# EAGLE design lumen (EAGLE 9.6.2)
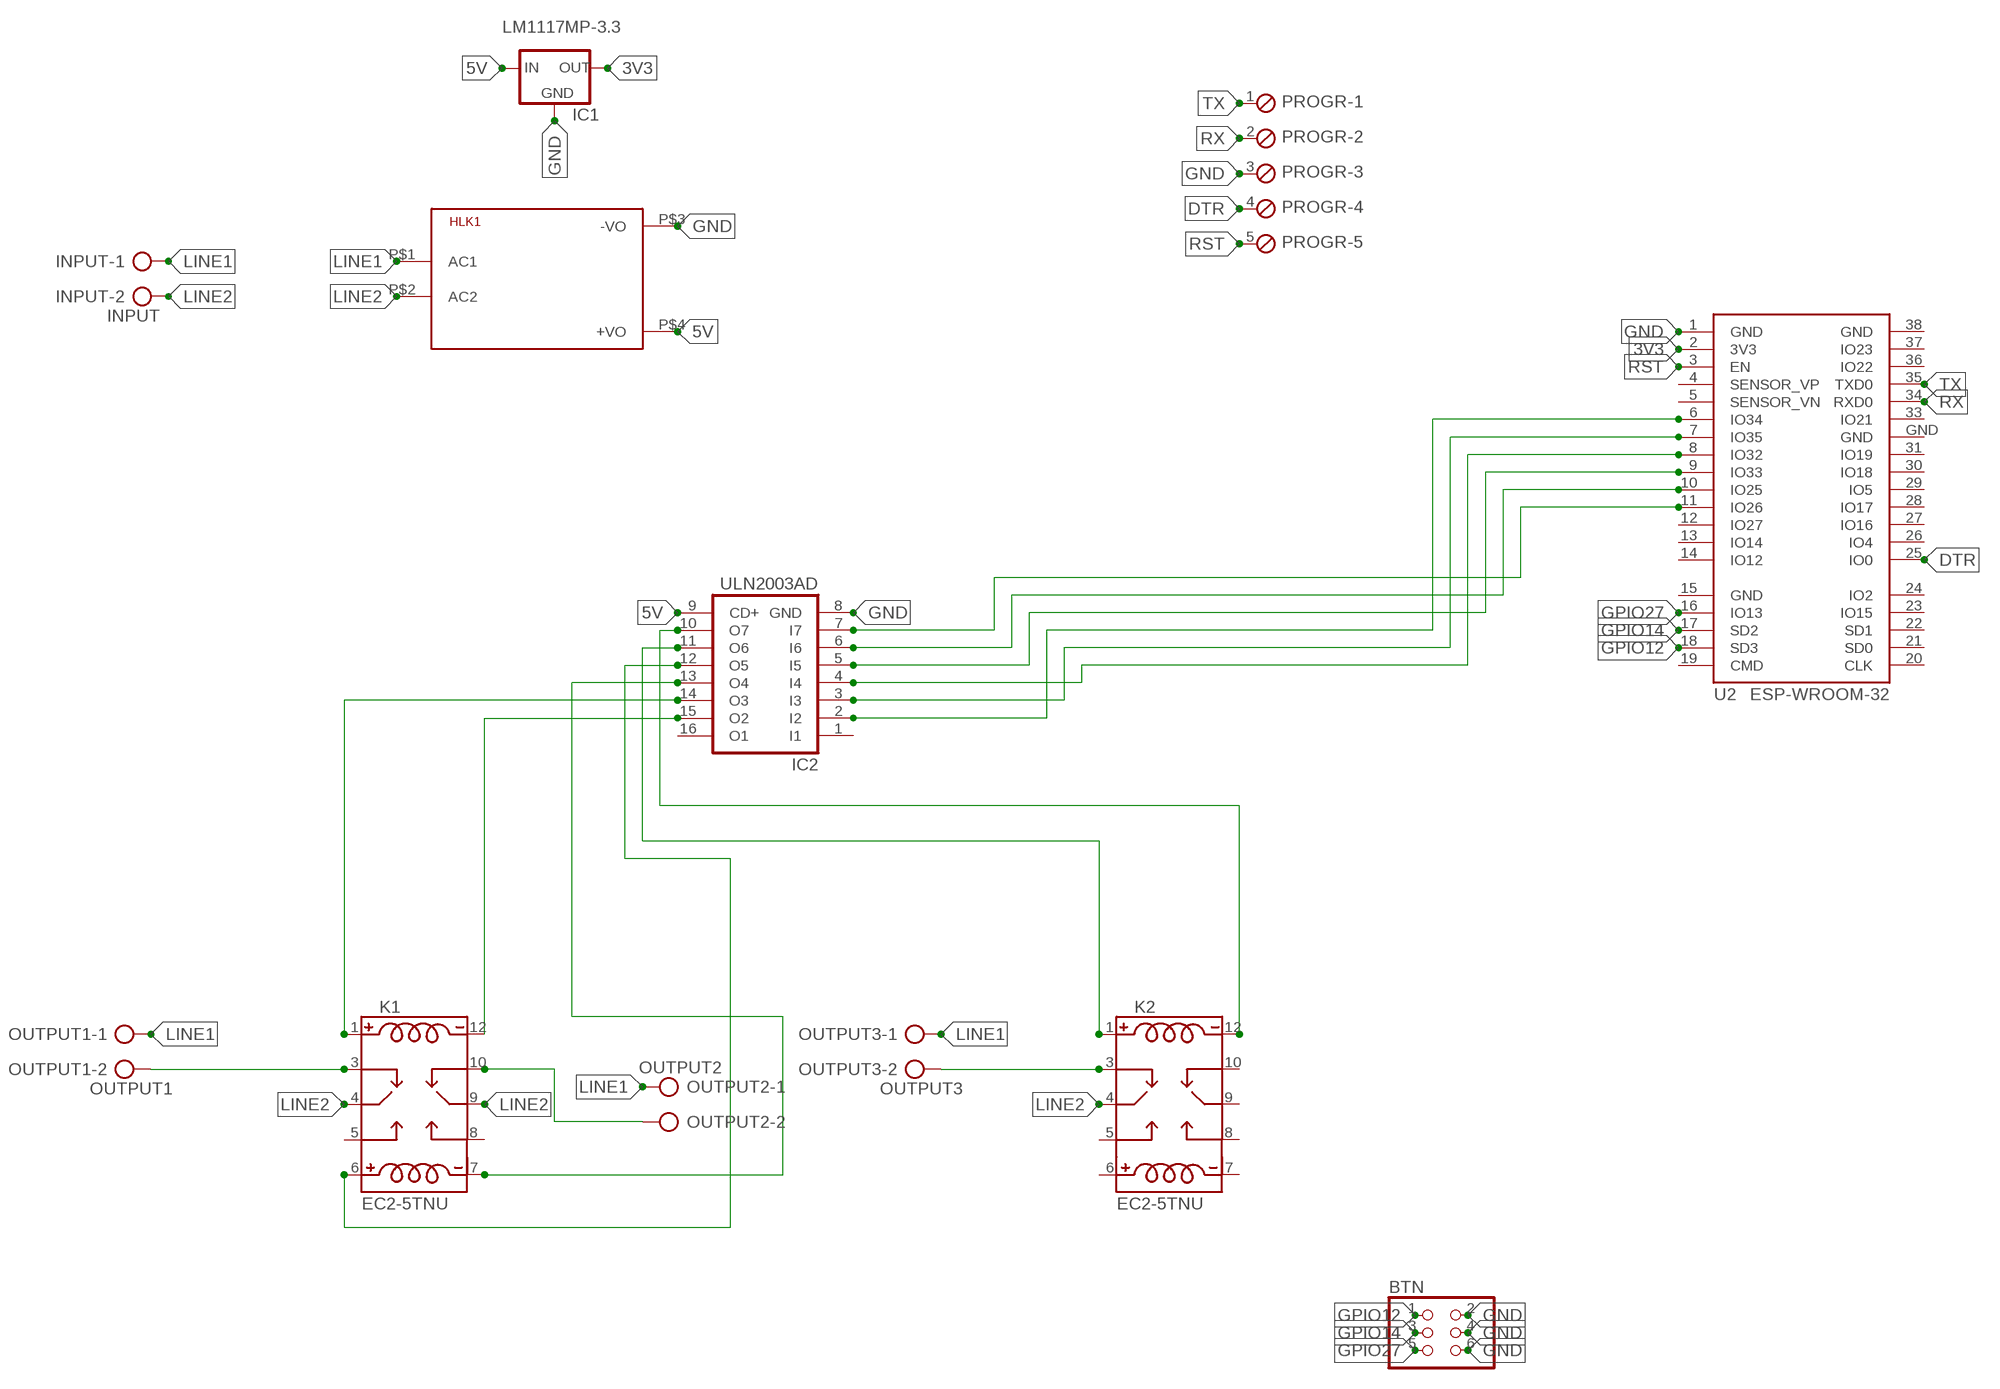
[diagram p0: schematic, sheet 1]

## Parts
BTN  PINHD-2X3  [2X03]
HLK1  HLK-PM013W  [HLK-PM01]
IC1  LM1117MP-3.3  [SOT223]
IC2  ULN2003AD  [SO16]
INPUT  INPUT  AK300/2  [AK300/2]
K1  EC2-5TNU  [RELAY_EC2-5TNU]
K2  EC2-5TNU  [RELAY_EC2-5TNU]
OUTPUT1  OUTPUT1  AK300/2  [AK300/2]
OUTPUT2  OUTPUT2  AK300/2  [AK300/2]
OUTPUT3  OUTPUT3  AK300/2  [AK300/2]
PROGR  MPT5  [5POL254]
U2  ESP-WROOM-32  [ESP-WROOM-32]

## Nets
3V3: IC1.2(OUT) IC1.4(OUT) U2.2(3V3)
5V: HLK1.P$4(+VO) IC1.3(IN) IC2.9(CD+)
DTR: PROGR.4 U2.25(IO0)
GND: BTN.2 BTN.4 BTN.6 HLK1.P$3(-VO) IC1.1(GND) IC2.8(GND) PROGR.3 U2.1(GND)
GPIO12: BTN.1 U2.18(SD3)
GPIO14: BTN.3 U2.17(SD2)
GPIO27: BTN.5 U2.16(IO13)
LINE1: HLK1.P$1(AC1) INPUT.1 OUTPUT1.1 OUTPUT2.1 OUTPUT3.1
LINE2: HLK1.P$2(AC2) INPUT.2 K1.4(M1) K1.9(M) K2.4(M1)
N$1: IC2.11(O6) K2.1(C1)
N$2: K2.3(NC1) OUTPUT3.2
N$3: IC2.10(O7) K2.12(C2)
N$4: IC2.15(O2) K1.12(C2)
N$5: IC2.14(O3) K1.1(C1)
N$6: K1.3(NC1) OUTPUT1.2
N$8: K1.10(NC) OUTPUT2.2
N$9: IC2.2(I2) U2.6(IO34)
N$11: IC2.13(O4) K1.7(C4)
N$13: IC2.12(O5) K1.6(C3)
N$15: IC2.3(I3) U2.7(IO35)
N$16: IC2.4(I4) U2.8(IO32)
N$17: IC2.5(I5) U2.9(IO33)
N$18: IC2.6(I6) U2.10(IO25)
N$19: IC2.7(I7) U2.11(IO26)
RST: PROGR.5 U2.3(EN)
RX: PROGR.2 U2.34(RXD0)
TX: PROGR.1 U2.35(TXD0)
Unconnected: IC2.1(I1) IC2.16(O1) K1.5(NO1) K1.8(NO) K2.5(NO1) K2.6(C3) K2.7(C4) K2.8(NO) K2.9(M) K2.10(NC) U2.4(SENSOR_VP) U2.5(SENSOR_VN) U2.12(IO27) U2.13(IO14) U2.14(IO12) U2.19(CMD) U2.20(CLK) U2.21(SD0) U2.22(SD1) U2.23(IO15) U2.24(IO2) U2.26(IO4) U2.27(IO16) U2.28(IO17) U2.29(IO5) U2.30(IO18) U2.31(IO19) U2.33(IO21) U2.36(IO22) U2.37(IO23)

## Power pins joined to a net without a drawn wire
GND: U2.15(GND) U2.38(GND) U2.GND

## Library data of the parts
BTN = pinhead:PINHD-2X3: PIN HEADER
HLK1 = HLK-PM01:HLK-PM01: Hi-Link Power Supply HLK-PM01 3W Author: Ahmed Said <https://github.com/AhmedSaid/EAGLELibraries>
IC1 = lm1117_10:LM1117?-*: 800mA Low-Dropout Linear Regulator Source: http://www.ti.com/lit/ds/symlink/lm1117-n.pdf; MF: Texas Instruments; MPN: LM1117MP-3.3; OC_FARNELL: 9778195; OC_NEWARK: 28X3416
IC2 = uln-udn:ULN2003A: DRIVER ARRAY
INPUT OUTPUT1-OUTPUT3 = MY-AK300:AK300/2: CONNECTOR; OC_FARNELL: unknown; OC_NEWARK: unknown
K1 K2 = EC2-5TNU:EC2-5TNU: Relay; E-Mech; Latching; DPDT; Ctrl-V 5DC; 2A; 250VAC; PCB Mnt; Thru Hole; EC2/EE2 Series Check prices <https://pricing.snapeda.com/parts/EC2-5TNU/KEMET/view-part?ref=eda>; AVAILABILITY: Good; DESCRIPTION: General Purpose Relay DPDT (2 Form C) Through Hole; MF: KEMET; MP: EC2-5TNU; PACKAGE: None; PRICE: None; PURCHASE-URL: https://pricing.snapeda.com/search/part/EC2-5TNU/?ref=eda
PROGR = con-phoenix-254:MPT5: PHOENIX CONNECTOR; OC_FARNELL: unknown; OC_NEWARK: unknown
U2 = esp32:ESP-WROOM-32: Espressif Systems ESP-WROOM-32

## Board
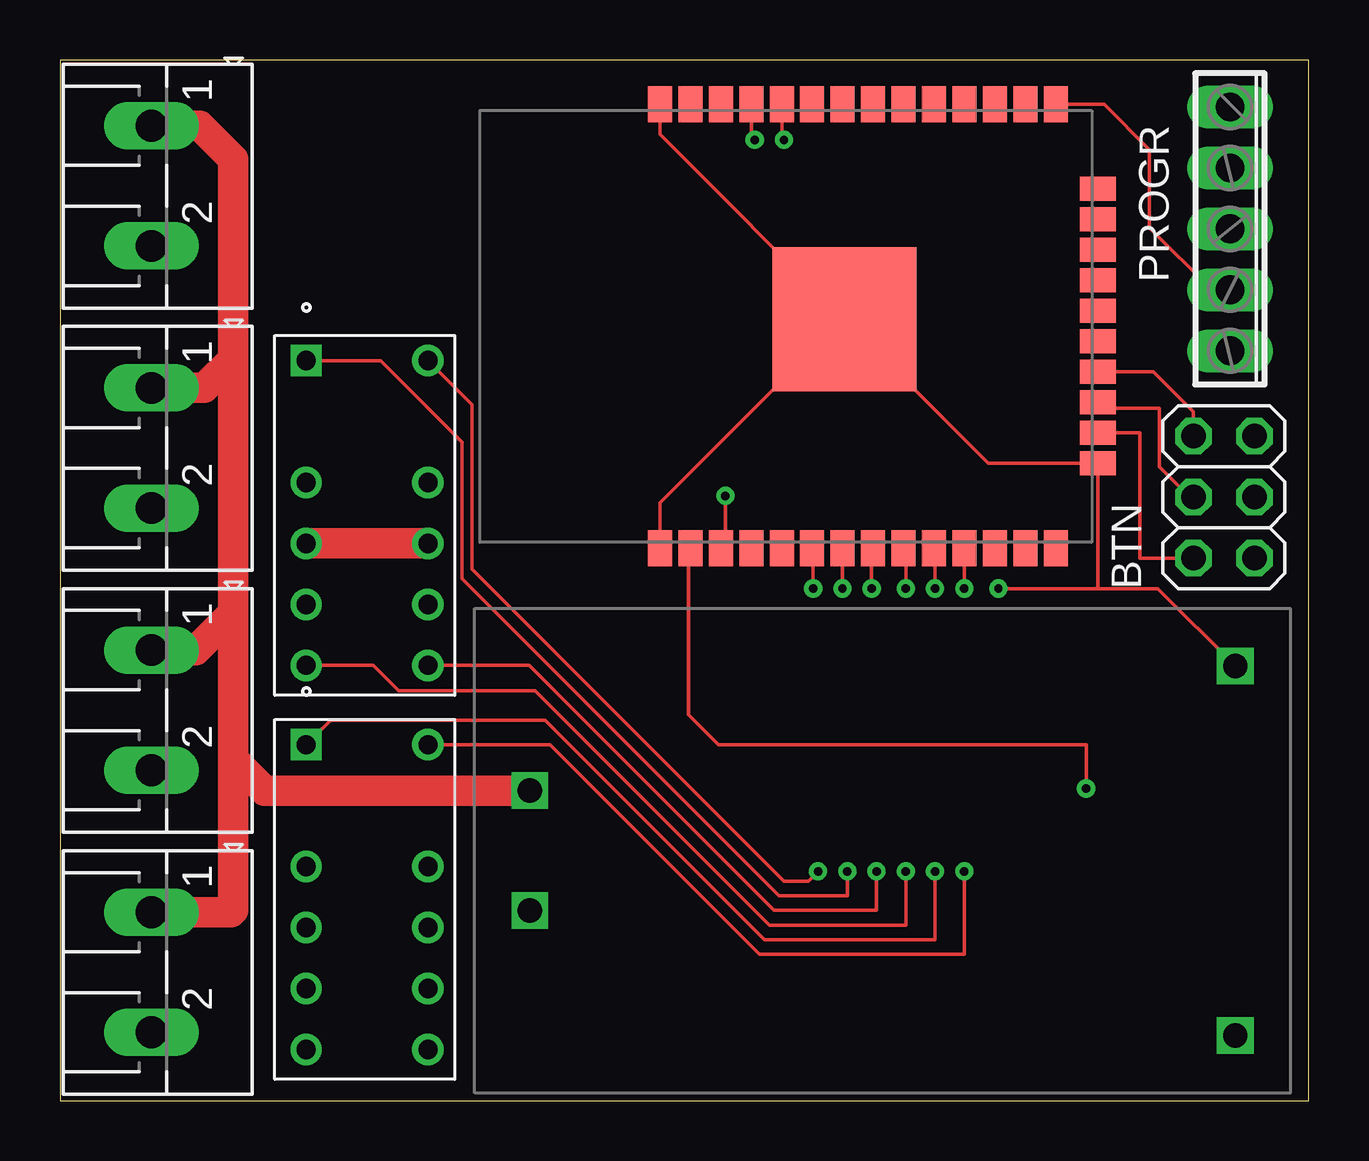
[diagram p1: board, top side]
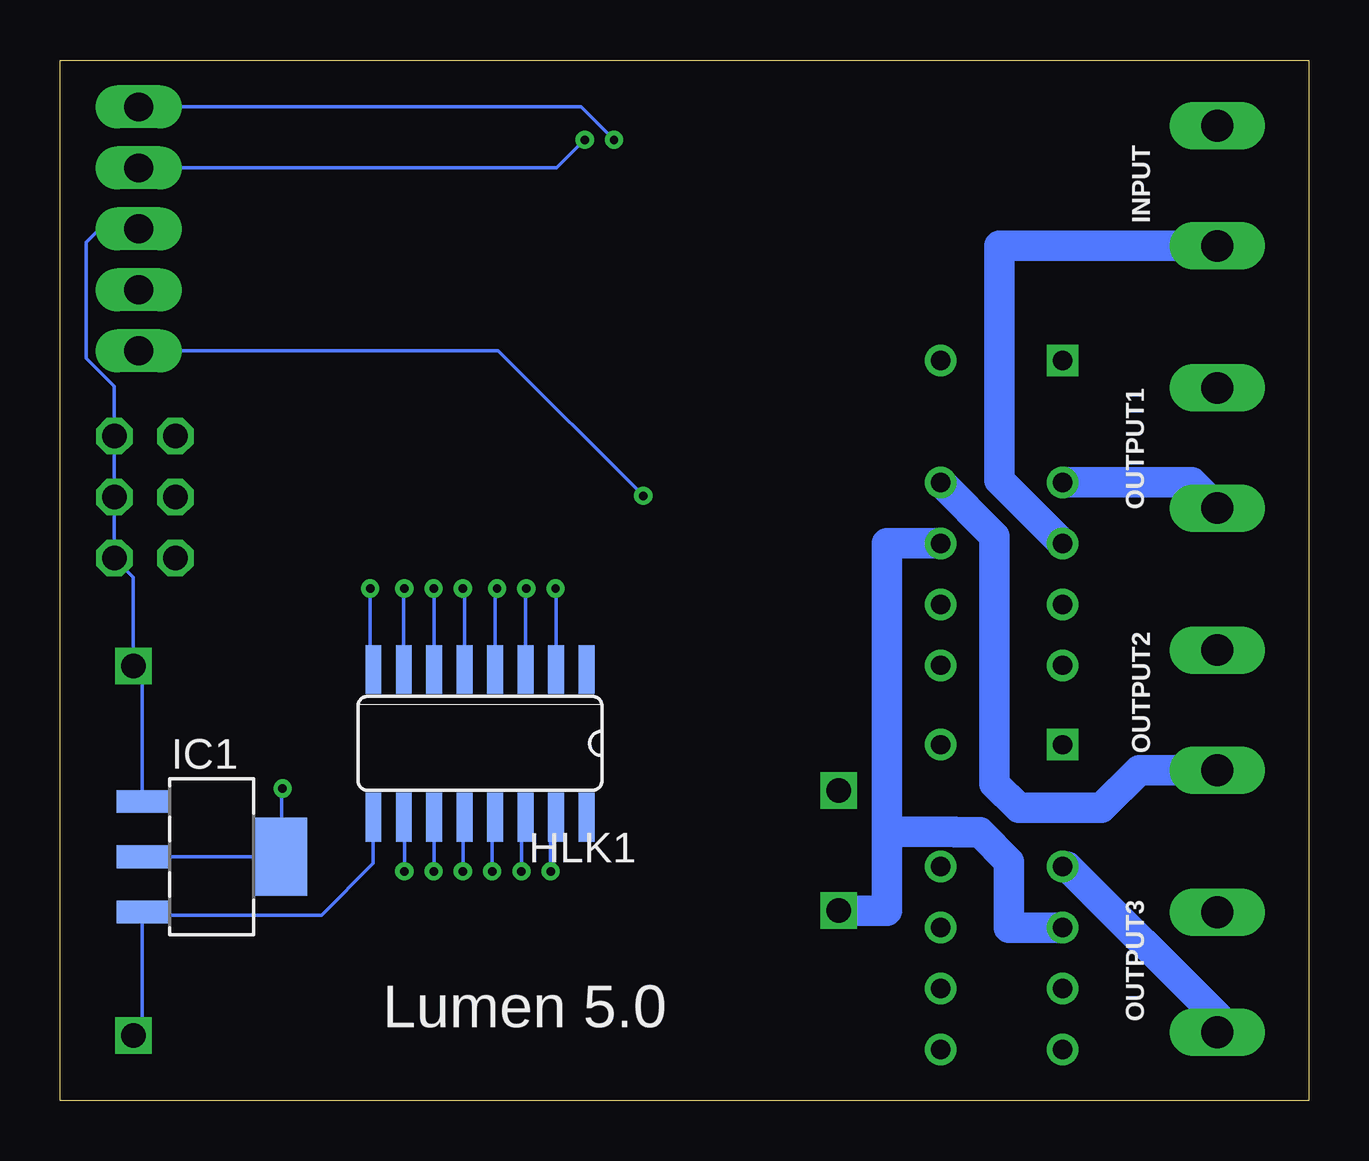
[diagram p2: board, bottom side, seen from below]

Size 52.05 x 43.36 mm. Coordinates in mm from the lower left corner, seen from the top.
Outline: 0,0 52.05,0 52.05,43.36 0,43.36 0,0
Copper layers (1*16): Top 0.035mm / dielectric 1.5mm / Bottom 0.035mm
Design rules "default": minimum track width 6mil, minimum drill 0.35mm, track to track 6mil, track to pad 6mil, pad to pad 6mil, via to via 6mil, smd to smd 6mil, copper to edge 40mil, drill to drill 6mil, minimum pad ring 10mil, minimum via ring 8mil, stop-mask expansion 4mil, vias tented up to drill 0mil, thermal gap 10mil

### Footprints (pad centres in the part's own frame; a part is rotated, then mirrored left to right if it is on the bottom)
2X03 = drill 1.016 octagon: 1 -2.54,-1.27; 2 -2.54,1.27; 3 0,-1.27; 4 0,1.27; 5 2.54,-1.27; 6 2.54,1.27
HLK-PM01 = drill 1.016 square: P$1 -14.7,2.5; P$2 -14.7,-2.5; P$3 14.7,7.7; P$4 14.7,-7.7
SOT223 = smd 0.95 x 2.15: 1 -2.3,-2.9; 2 0,-2.9; 3 2.3,-2.9 | smd 3.25 x 2.15: 4 0,2.9
SO16 = smd 0.66 x 2.032: 1 -4.445,-3.073; 2 -3.175,-3.073; 3 -1.905,-3.073; 4 -0.635,-3.073; 5 0.635,-3.073; 6 1.905,-3.073; 7 3.175,-3.073; 8 4.445,-3.073; 9 4.445,3.073; 10 3.175,3.073; 11 1.905,3.073; 12 0.635,3.073; 13 -0.635,3.073; 14 -1.905,3.073; 15 -3.175,3.073; 16 -4.445,3.073
AK300/2 = drill 1.321 long: 1 -2.515,0; 2 2.489,0
RELAY_EC2-5TNU = drill 0.8 square: 1 -6.45,-2.44 | drill 0.8: 3 -1.37,-2.44; 4 1.17,-2.44; 5 3.71,-2.44; 6 6.25,-2.44; 7 6.25,2.64; 8 3.71,2.64; 9 1.17,2.64; 10 -1.37,2.64; 12 -6.45,2.64
5POL254 = drill 1.2 long: 1 -5.08,0; 2 -2.54,0; 3 0,0; 4 2.54,0; 5 5.08,0
ESP-WROOM-32 = smd 1.5 x 1: 1 -9.25,7; 2 -9.25,5.73; 3 -9.25,4.46; 4 -9.25,3.19; 5 -9.25,1.92; 6 -9.25,0.65; 7 -9.25,-0.62; 8 -9.25,-1.89; 9 -9.25,-3.16; 10 -9.25,-4.43; 11 -9.25,-5.7; 12 -9.25,-6.97; 13 -9.25,-8.24; 14 -9.25,-9.51; 25 9.25,-9.51; 26 9.25,-8.24; 27 9.25,-6.97; 28 9.25,-5.7; 29 9.25,-4.43; 30 9.25,-3.16; 31 9.25,-1.89; 32 9.25,-0.62; 33 9.25,0.65; 34 9.25,1.92; 35 9.25,3.19; 36 9.25,4.46; 37 9.25,5.73; 38 9.25,7 | smd 1 x 1.5: 15 -5.7,-11.25; 16 -4.43,-11.25; 17 -3.16,-11.25; 18 -1.89,-11.25; 19 -0.62,-11.25; 20 0.65,-11.25; 21 1.92,-11.25; 22 3.19,-11.25; 23 4.46,-11.25; 24 5.73,-11.25 | smd 6 x 6: GND 0.3,-0.7

### Placement (x,y rotation side)
BTN  48.51,25.15 270 top
HLK1  34.29,10.41 0 top
IC1  45.72,10.16 270 bottom
IC2  34.54,14.88 180 bottom
INPUT  3.81,38.1 270 top
K1  12.7,24.38 270 top
K2  12.7,8.38 270 top
OUTPUT1  3.81,27.18 270 top
OUTPUT2  3.81,16.26 270 top
OUTPUT3  3.81,5.33 270 top
PROGR  48.77,36.32 270 top
U2  32,32.26 90 top

### Tracks (layer width: path | path; a pad name or v marks a point on that pad's centre or on a via)
3V3  (via drill 0.35)
  Top 0.152: U2.2 26.21,22.94 26.21,16.07 27.44,14.83 42.77,14.83 v42.77,13.01
  Bottom 0.152: IC1.2 IC1.4 42.82,12.96 v42.77,13.01
5V
  Bottom 0.152: IC2.9 38.99,9.88 41.15,7.72 48.48,7.72 IC1.3 48.62,3.08 HLK1.P$4
DTR
  Top 0.152: PROGR.4 48.01,33.78 45.41,36.37 45.41,39.62 43.53,41.51 U2.25
GND  (via drill 0.35)
  Top 0.152: 43.18,21.34 v39.12,21.34 | 43.18,21.34 43.25,21.41 U2.15 38.7,26.56 U2.GND 32.68,32.58 | 43.18,21.34 45.77,21.34 HLK1.P$3 | U2.38 25,40.26 32.68,32.58 | U2.1 25,24.9 32.68,32.58
  Bottom 0.152: IC1.1 48.62,17.74 HLK1.P$3 48.99,21.81 BTN.6 BTN.4 BTN.2 49.78,29.76 50.96,30.94 50.96,35.76 50.4,36.32 PROGR.3 | v39.12,21.34 39.12,18.09 IC2.8
GPIO12
  Top 0.152: U2.18 45.58,30.37 47.24,28.7 BTN.1
GPIO14
  Top 0.152: U2.17 43.5,28.85 45.82,28.85 45.82,26.42 47.09,25.15 BTN.3
GPIO27
  Top 0.152: U2.16 45.01,27.83 45.01,22.61 BTN.5
LINE1
  Top 1.27: INPUT.1 5.82,40.62 7.21,39.22 7.21,30.89 | 7.21,30.89 7.21,20.32 | 7.21,20.32 7.21,14.22 | 7.21,14.22 7.21,7.92 7.14,7.85 OUTPUT3.1 | OUTPUT1.1 6.02,29.69 7.21,30.89 | OUTPUT2.1 5.66,18.77 7.21,20.32 | HLK1.P$1 8.52,12.91 7.21,14.22
LINE2
  Top 1.27: K1.4 K1.9
  Bottom 1.27: INPUT.2 12.9,35.61 12.9,25.86 K1.4 | K1.9 17.58,23.21 17.58,11.58 | 17.58,11.58 17.58,7.91 HLK1.P$2 | 17.58,11.58 17.19,11.19 14.74,11.19 14.73,11.18 13.72,11.18 12.5,9.96 12.5,7.21 K2.4
N$1  (via drill 0.35)
  Top 0.152: K2.1 11.28,15.85 20.22,15.85 29.36,6.71 36.47,6.71 v36.47,9.55
  Bottom 0.152: v36.47,9.55 36.45,9.58 IC2.11
N$2
  Bottom 1.27: OUTPUT3.2 3.81,3.5 10.06,9.75 K2.3
N$3  (via drill 0.35)
  Top 0.152: K2.12 20.42,14.83 29.16,6.1 37.69,6.1 v37.69,9.55
  Bottom 0.152: v37.69,9.55 37.69,11.79 IC2.10
N$4  (via drill 0.35)
  Top 0.152: K1.12 17.17,29 17.17,22.15 30.18,9.14 31.19,9.14 v31.6,9.55
  Bottom 0.152: v31.6,9.55 31.6,11.58 IC2.15
N$5  (via drill 0.35)
  Top 0.152: K1.1 13.36,30.83 16.76,27.43 16.76,21.74 29.97,8.53 32.82,8.53 v32.82,9.55
  Bottom 0.152: IC2.14 32.82,11.63 v32.82,9.55
N$6
  Bottom 1.27: K1.3 4.88,25.75 OUTPUT1.2
N$8
  Bottom 1.27: OUTPUT2.2 7.06,13.77 8.64,12.19 12.09,12.19 13.11,13.21 13.11,23.52 K1.10
N$9  (via drill 0.35)
  Top 0.152: v31.39,21.34 31.39,23.01 U2.6
  Bottom 0.152: IC2.2 31.37,21.34 v31.39,21.34
N$11  (via drill 0.35)
  Top 0.152: K1.7 19.56,18.13 29.77,7.92 34.04,7.92 v34.04,9.55
  Bottom 0.152: IC2.13 34.04,11.68 v34.04,9.55
N$13  (via drill 0.35)
  Top 0.152: K1.6 13.06,18.13 14.12,17.07 19.81,17.07 29.57,7.32 35.26,7.32 v35.26,9.55
  Bottom 0.152: IC2.12 35.26,11.73 v35.26,9.55
N$15  (via drill 0.35)
  Top 0.152: v32.61,21.34 U2.7
  Bottom 0.152: IC2.3 32.64,21.34 v32.61,21.34
N$16  (via drill 0.35)
  Top 0.152: v33.83,21.34 33.83,22.95 U2.8
  Bottom 0.152: IC2.4 33.91,21.26 v33.83,21.34
N$17  (via drill 0.35)
  Top 0.152: v35.26,21.34 35.26,22.92 U2.9
  Bottom 0.152: IC2.5 35.18,21.26 v35.26,21.34
N$18  (via drill 0.35)
  Top 0.152: v36.47,21.34 36.47,22.97 U2.10
  Bottom 0.152: IC2.6 36.45,21.31 v36.47,21.34
N$19  (via drill 0.35)
  Top 0.152: v37.69,21.34 U2.11
  Bottom 0.152: IC2.7 37.72,21.31 v37.69,21.34
RST  (via drill 0.35)
  Top 0.152: v27.74,25.2 27.74,23.2 U2.3
  Bottom 0.152: PROGR.5 33.78,31.24 v27.74,25.2
RX  (via drill 0.35)
  Top 0.152: v30.18,40.03 30.08,40.12 U2.34
  Bottom 0.152: PROGR.2 31.34,38.86 v30.18,40.03
TX  (via drill 0.35)
  Top 0.152: v28.96,40.03 28.81,40.17 U2.35
  Bottom 0.152: PROGR.1 30.33,41.4 v28.96,40.03

### Text on the board
bNames: Lumen 5.0